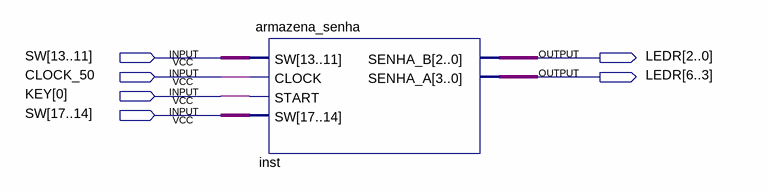
[diagram p0: schematic sheet]
// Quartus schematic projeto_final.bdf as structural Verilog: 1 symbols, 6 pins
module projeto_final (
  input  [17:11] SW,
  input  CLOCK_50,
  input  [0:0] KEY,
  output [6:0] LEDR
);

  armazena_senha inst (.SW(SW), .CLOCK(CLOCK_50), .START(KEY[0]), .SENHA_B(LEDR[2:0]), .SENHA_A(LEDR[6:3]));
endmodule
